# Altium schematic sheet clock_led.SchDoc: Clock Monsieur
size 290 x 209 mm; Author: chs; SheetNumber: 1; SheetTotal: 3
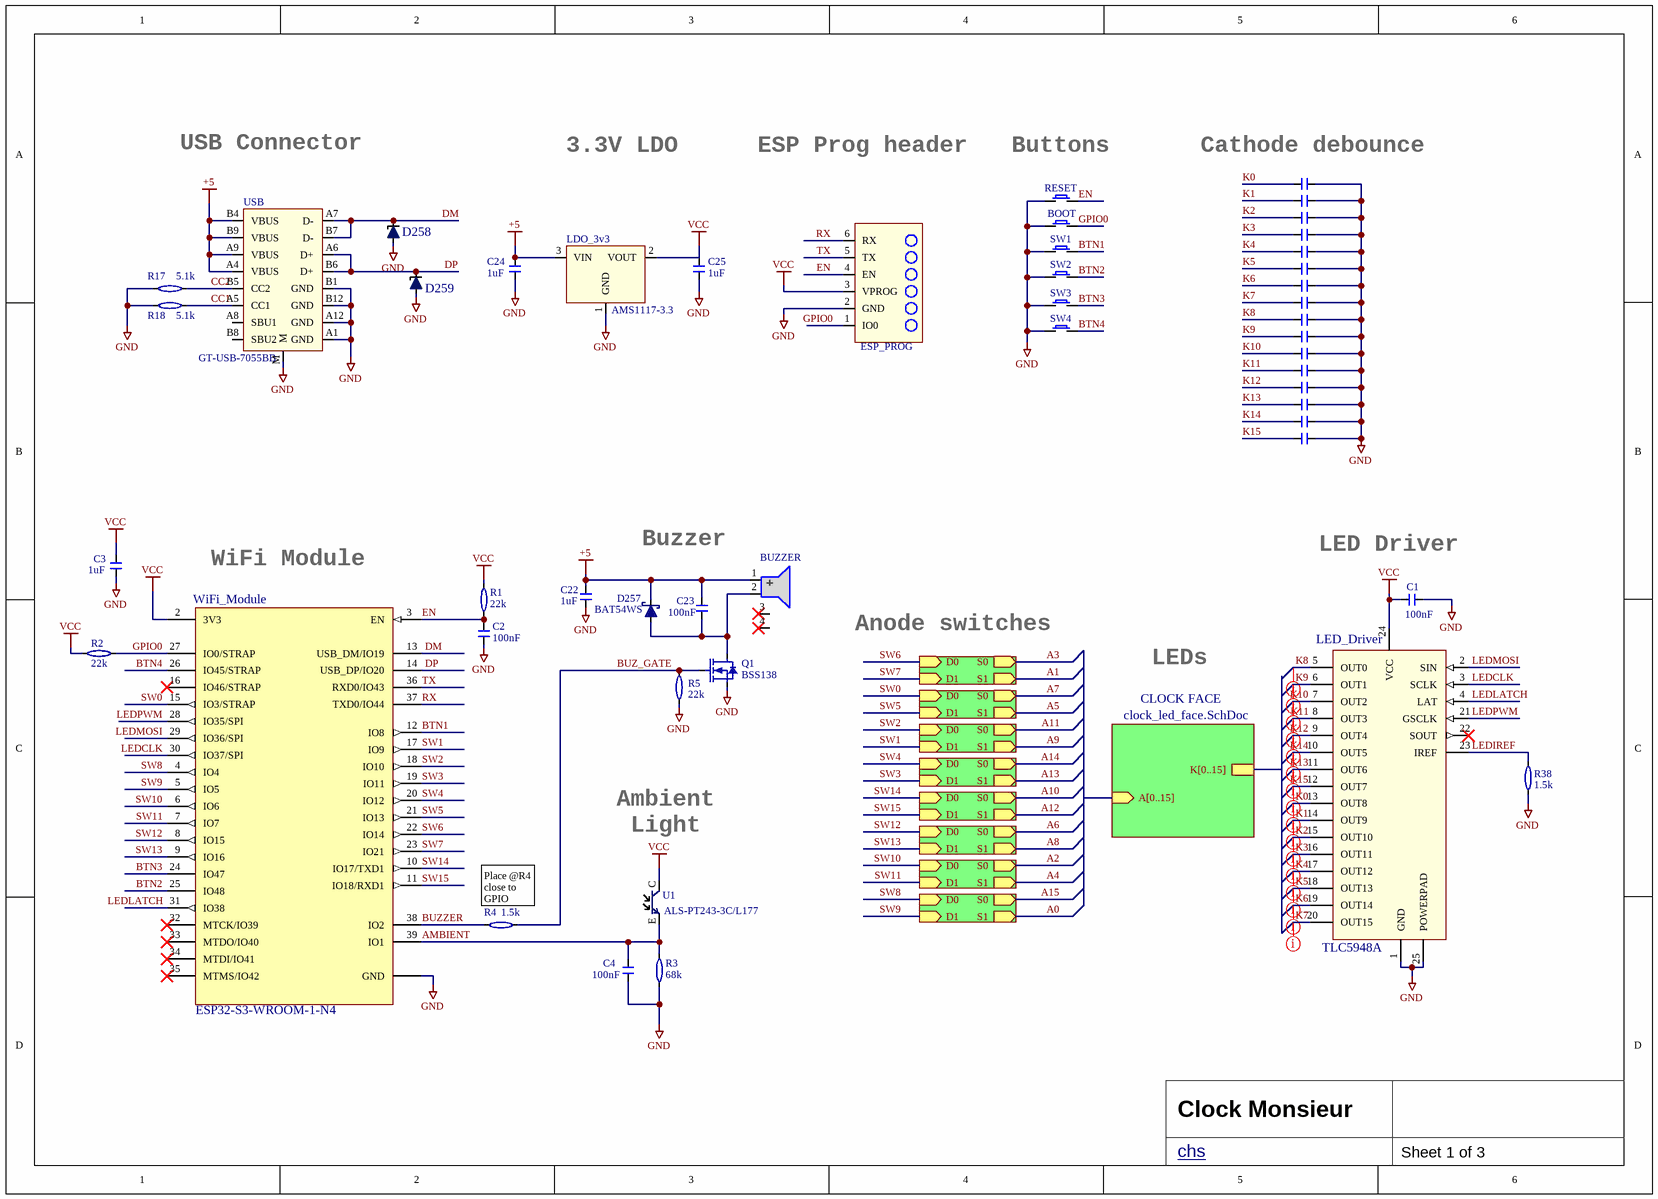
[diagram p0: clock_led.SchDoc]

## Parts
BOOT  SW-SMD_YZA-072-7.0  [FSM-SWITCH-6x6x7.0]  (value not drawn)
BUZZER  BUZZER_MLT-7525  [BUZZER_XHXDZ_SMD8530]  (value not drawn)
C1  100nF  [CAPC_0603_1608X08L]
C2  100nF  [CAPC_0603_1608X08L]
C3  1uF  [CAPC_1206_3216X16L]
C4  100nF  [CAPC_0603_1608X08L]
C5  100pF  [CAP_0402]  (value not drawn)
C6  100pF  [CAP_0402]  (value not drawn)
C7  100pF  [CAP_0402]  (value not drawn)
C8  100pF  [CAP_0402]  (value not drawn)
C9  100pF  [CAP_0402]  (value not drawn)
C10  100pF  [CAP_0402]  (value not drawn)
C11  100pF  [CAP_0402]  (value not drawn)
C12  100pF  [CAP_0402]  (value not drawn)
C13  100pF  [CAP_0402]  (value not drawn)
C14  100pF  [CAP_0402]  (value not drawn)
C15  100pF  [CAP_0402]  (value not drawn)
C16  100pF  [CAP_0402]  (value not drawn)
C17  100pF  [CAP_0402]  (value not drawn)
C18  100pF  [CAP_0402]  (value not drawn)
C19  100pF  [CAP_0402]  (value not drawn)
C20  100pF  [CAP_0402]  (value not drawn)
C22  1uF  [CAPC_1206_3216X16L]
C23  100nF  [CAPC_0603_1608X08L]
C24  1uF  [CAPC_1206_3216X16L]
C25  1uF  [CAPC_1206_3216X16L]
D257  BAT54WS  [SODFL250X100-2L]
D258  TVS_DIODE  [TVS_DIODE]  (value not drawn)
D259  TVS_DIODE  [TVS_DIODE]  (value not drawn)
ESP_PROG  ESP_PROG  [ESP_PROG]  (value not drawn)  (no BOM)
LDO_3v3  AMS1117-3.3  [SOT223_LDO]
LED_Driver  TLC5948A  [TSSOP24]
Q1  BSS138  [SOT95P230X110-3L]
R1  22k  [RES 0402_1005 RF]
R2  22k  [RES 0402_1005 RF]
R3  68k  [RES 0402_1005 RF]
R4  1.5k  [RES 0402_1005 RF]
R5  22k  [RES 0402_1005 RF]
R17  5.1k  [RES 0402_1005 RF]
R18  5.1k  [RES 0402_1005 RF]
R38  1.5k  [RES 0402_1005 RF]
RESET  SW-SMD_YZA-072-5.5  [FSM-SWITCH-6x6x5.5]  (value not drawn)
SW1  SW-SMD_YZA-072-7.0  [FSM-SWITCH-6x6x7.0]  (value not drawn)
SW2  SW-SMD_YZA-072-7.0  [FSM-SWITCH-6x6x7.0]  (value not drawn)
SW3  SW-SMD_YZA-072-7.0  [FSM-SWITCH-6x6x7.0]  (value not drawn)
SW4  SW-SMD_YZA-072-7.0  [FSM-SWITCH-6x6x7.0]  (value not drawn)
U1  ALS-PT243-3C/L177  [ALS-PT243-3C]  (no BOM)
USB  GT-USB-7055BB  [USB-C-TH_GT-USB-7055BB]
WiFi_Module  ESP32-S3-WROOM-1-N4  [XCVR_ESP32-S3-WROOM-1-N16R2]

## Sub-sheets
CLOCK FACE = clock_led_face.SchDoc: A[0..15] (in), K[0..15]
D = clock_led_dual_switch.SchDoc: D0 (in), D1 (in), S0 (out), S1 (out)
D = clock_led_dual_switch.SchDoc: D0 (in), D1 (in), S0 (out), S1 (out)
D = clock_led_dual_switch.SchDoc: D0 (in), D1 (in), S0 (out), S1 (out)
D = clock_led_dual_switch.SchDoc: D0 (in), D1 (in), S0 (out), S1 (out)
D = clock_led_dual_switch.SchDoc: D0 (in), D1 (in), S0 (out), S1 (out)
D = clock_led_dual_switch.SchDoc: D0 (in), D1 (in), S0 (out), S1 (out)
D = clock_led_dual_switch.SchDoc: D0 (in), D1 (in), S0 (out), S1 (out)
D = clock_led_dual_switch.SchDoc: D0 (in), D1 (in), S0 (out), S1 (out)

## Nets
+5: BUZZER.1(VCC) C22.1 C23.1 C24.2 D257.K LDO_3v3.3(VIN) USB.A4(VBUS) USB.A9(VBUS) USB.B4(VBUS) USB.B9(VBUS)
GND: BOOT.1(A) C1.1 C2.2 C3.2 C4.2 C5.1 C6.1 C7.1 C8.1 C9.1 C10.1 C11.1 C12.1 C13.1 C14.1 C15.1 C16.1 C17.1 C18.1 C19.1 C20.1 C22.2 C24.1 C25.2 D258.A D259.A ESP_PROG.2(GND) LDO_3v3.1(GND) LED_Driver.1(GND) LED_Driver.25(POWERPAD) Q1.S R3.2 R5.2 R17.2 R18.2 R38.2 RESET.1(A) SW1.1(A) SW2.1(A) SW3.1(A) SW4.1(A) USB.A1(GND) USB.A12(GND) USB.B1(GND) USB.B12(GND) USB.M WiFi_Module.GND
VCC: C1.2 C3.1 C25.1 ESP_PROG.3(VPROG) LDO_3v3.2(VOUT) LED_Driver.24(VCC) R1.1 R2.1 U1.C WiFi_Module.2(3V3)
A0: sheet D/S1
A1: sheet D/S1
A2: sheet D/S0
A3: sheet D/S0
A4: sheet D/S1
A5: sheet D/S1
A6: sheet D/S0
A7: sheet D/S0
A8: sheet D/S1
A9: sheet D/S1
A10: sheet D/S0
A11: sheet D/S0
A12: sheet D/S1
A13: sheet D/S1
A14: sheet D/S0
A15: sheet D/S0
AMBIENT: C4.1 R3.1 U1.E WiFi_Module.39(IO1)
BTN1: SW1.2(B) WiFi_Module.12(IO8)
BTN2: SW2.2(B) WiFi_Module.25(IO48)
BTN3: SW3.2(B) WiFi_Module.24(IO47)
BTN4: SW4.2(B) WiFi_Module.26(IO45/STRAP)
BUZ_GATE: Q1.G R4.1 R5.1
BUZZER: R4.2 WiFi_Module.38(IO2)
CC1: R18.1 USB.A5(CC1)
CC2: R17.1 USB.B5(CC2)
DM: D258.K USB.A7(D-) USB.B7(D-) WiFi_Module.13(USB_DM/IO19)
DP: D259.K USB.A6(D+) USB.B6(D+) WiFi_Module.14(USB_DP/IO20)
EN: C2.1 ESP_PROG.4(EN) R1.2 RESET.2(B) WiFi_Module.3(EN)
GPIO0: BOOT.2(B) ESP_PROG.1(IO0) R2.2 WiFi_Module.27(IO0/STRAP)
K0: C5.2 LED_Driver.13(OUT8)
K1: C6.2 LED_Driver.14(OUT9)
K2: C7.2 LED_Driver.15(OUT10)
K3: C8.2 LED_Driver.16(OUT11)
K4: C9.2 LED_Driver.17(OUT12)
K5: C10.2 LED_Driver.18(OUT13)
K6: C11.2 LED_Driver.19(OUT14)
K7: C12.2 LED_Driver.20(OUT15)
K8: C13.2 LED_Driver.5(OUT0)
K9: C14.2 LED_Driver.6(OUT1)
K10: C15.2 LED_Driver.7(OUT2)
K11: C16.2 LED_Driver.8(OUT3)
K12: C17.2 LED_Driver.9(OUT4)
K13: C18.2 LED_Driver.11(OUT6)
K14: C19.2 LED_Driver.10(OUT5)
K15: C20.2 LED_Driver.12(OUT7)
LEDCLK: LED_Driver.3(SCLK) WiFi_Module.30(IO37/SPI)
LEDIREF: LED_Driver.23(IREF) R38.1
LEDLATCH: LED_Driver.4(LAT) WiFi_Module.31(IO38)
LEDMOSI: LED_Driver.2(SIN) WiFi_Module.29(IO36/SPI)
LEDPWM: LED_Driver.21(GSCLK) WiFi_Module.28(IO35/SPI)
RX: ESP_PROG.6(RX) WiFi_Module.37(TXD0/IO44)
SW0: WiFi_Module.15(IO3/STRAP) ; sheet D/D0
SW1: WiFi_Module.17(IO9) ; sheet D/D1
SW2: WiFi_Module.18(IO10) ; sheet D/D0
SW3: WiFi_Module.19(IO11) ; sheet D/D1
SW4: WiFi_Module.20(IO12) ; sheet D/D0
SW5: WiFi_Module.21(IO13) ; sheet D/D1
SW6: WiFi_Module.22(IO14) ; sheet D/D0
SW7: WiFi_Module.23(IO21) ; sheet D/D1
SW8: WiFi_Module.4(IO4) ; sheet D/D0
SW9: WiFi_Module.5(IO5) ; sheet D/D1
SW10: WiFi_Module.6(IO6) ; sheet D/D0
SW11: WiFi_Module.7(IO7) ; sheet D/D1
SW12: WiFi_Module.8(IO15) ; sheet D/D0
SW13: WiFi_Module.9(IO16) ; sheet D/D1
SW14: WiFi_Module.10(IO17/TXD1) ; sheet D/D0
SW15: WiFi_Module.11(IO18/RXD1) ; sheet D/D1
TX: ESP_PROG.5(TX) WiFi_Module.36(RXD0/IO43)
NetBUZZER_2: BUZZER.2(GND) C23.2 D257.A Q1.D

Not connected (* = marked no-connect by the designer): BUZZER 3(DNC)* 4(DNC)*; LED_Driver 22(SOUT)*; USB A8(SBU1) B8(SBU2); WiFi_Module 16(IO46/STRAP)* 32(MTCK/IO39)* 33(MTDO/IO40)* 34(MTDI/IO41)* 35(MTMS/IO42)*

## Layout directives
net class CATHODES: K0, K1, K2, K3, K4, K5, K6, K7, K8, K9, K10, K11, K12, K13, K14, K15

## Notes on the sheet
- USB Connector
- 3.3V LDO
- ESP Prog header
- Buttons
- Cathode debounce
- (near WiFi_Module) WiFi Module
- Buzzer
- (near C1) LED Driver
- Anode switches
- LEDs
- Ambient Light Sensor
- (near R4) Place @R4 close to GPIO

## Library data of the parts
BOOT SW1-SW4 = SW-SMD_YZA-072-7.0: 5.2x5.2x1.2mm Tactile Switch; JLCPCB: C722968
C1 C4 C23 = CAP_0603_100nF: Ceramic capacitor 0603; Value: 100nF; JLCPCB: C7501158
C2 = CAP_0402_100nF: Ceramic capacitor 0402; Value: 100nF; JLCPCB: C7501158
C3 C22 C24 C25 = CAP_1206_1uF: Ceramic capacitor 1206; Value: 1uF; JLCPCB: C5448921
C5-C20 = CAP_0402_100pF: Ceramic capacitor 0402; Value: 100pF; JLCPCB: C1546
D257 = BAT54WS: Schottky Diode 20v 500mA; JLCPCB: C27636123
D258 D259 = TVS_DIODE: TVS Diode; JLCPCB: C151980
LDO_3v3 = AMS1117-3.3: 3.3V LDO; JLCPCB: C18906017
LED_Driver = TLC5948: 16 Channel CC Led Driver; JLCPCB: C702084
Q1 = BSS138: P channel mosfet 1.2A; JLCPCB: C3015220
R1 R2 R5 = RES_0402_22k: Chip Resistor; Value: 22k; JLCPCB: C2906913
R3 = RES_0402_68k: Chip Resistor; Value: 68k; JLCPCB: C3017593
R4 R38 = RES_0402_1.5k: Chip Resistor; Value: 1.5k; JLCPCB: C2933074
R17 R18 = RES_0402_5.1k: Chip Resistor; Value: 5.1k; JLCPCB: C2906948
RESET = SW-SMD_YZA-072-5.5: 5.2x5.2x1.2mm Tactile Switch; JLCPCB: C722967
U1 = PHOTOTRANSISTOR
USB = GT-USB-7055BB: USB Connector, vertical; JLCPCB: C7450621
WiFi_Module = ESP32-S3-WROOM-1-N4: ESP32 Module, 4MB Flash, No PSRAM; JLCPCB: C2913197
BUZZER = BUZZER_MLT-7525: JLCPCB: C95299